# EAGLE design OneWire_I2C (EAGLE 7.2.0)
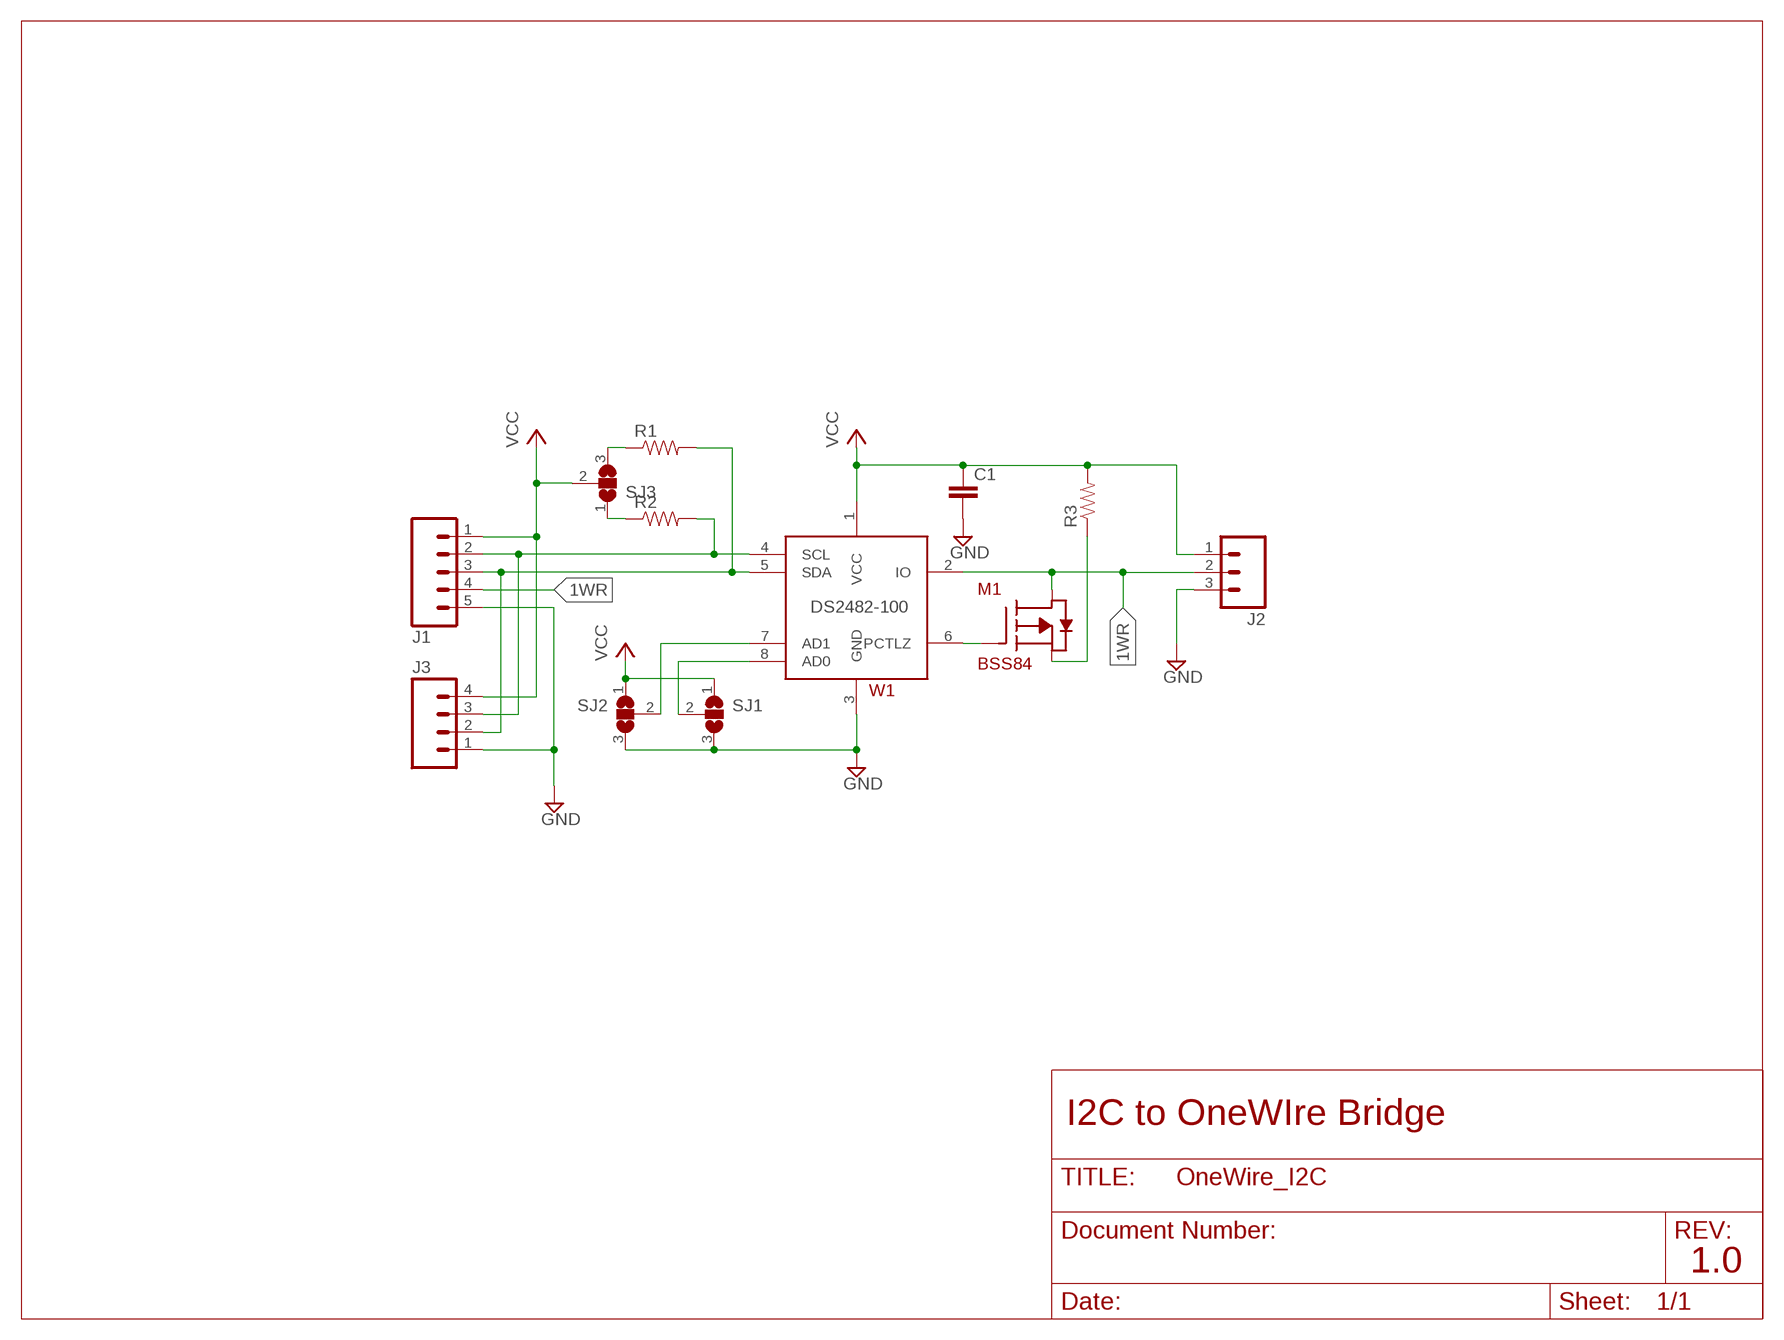
[diagram p0: schematic, sheet 1]

## Parts
C1  CAP0603-CAP  [0603-CAP]
J1  M05PTH  [1X05]
J2  M03SCREW  [SCREWTERMINAL-3.5MM-3]
J3  M04SCREW  [SCREWTERMINAL-3.5MM-4]
M1  BSS84  [SOT-23]
R1  RESISTOR0603  [0603-RES]
R2  RESISTOR0603  [0603-RES]
R3  RESISTORPTH-1/4W  [AXIAL-0.4]
SJ1  SJ2W  [SJ_2]
SJ2  SJ2W  [SJ_2]
SJ3  SJ2W  [SJ_2]
W1  DS2482-100  [SOIC8]

## Nets
1WR: J1.4 J2.2 M1.3 W1.2(IO)
AD0: SJ1.2 W1.8(AD0)
AD1: SJ2.2 W1.7(AD1)
GND: C1.2 J1.5 J2.3 J3.1 SJ1.3 SJ2.3 W1.3(GND)
N$1: M1.1 W1.6(PCTLZ)
N$2: R1.1 SJ3.3
N$3: R2.1 SJ3.1
N$10: M1.2 R3.P$1
SCL: J1.2 J3.3 R2.2 W1.4(SCL)
SDA: J1.3 J3.2 R1.2 W1.5(SDA)
VCC: C1.1 J1.1 J2.1 J3.4 R3.P$2 SJ1.1 SJ2.1 SJ3.2 W1.1(VCC)

## Notes on the sheet
- I2C to OneWIre Bridge
- 1.0

## Library data of the parts
C1 = SparkFun-Capacitors:CAP: Capacitor Standard 0603 ceramic capacitor, and 0.1" leaded capacitor.
J1 = SparkFun-Connectors:M05: Header 5 Standard 5-pin 0.1" header. Use with straight break away headers (SKU : PRT-00116), right angle break away headers (PRT-00553), swiss pins (PRT-00743), machine pins (PRT-00117), and female headers (PRT-00115). Molex polarized connector foot print use with SKU : PRT-08230 with associated crimp pins and housings.
J2 = SparkFun-Connectors:M03: Header 3 Standard 3-pin 0.1" header. Use with straight break away headers (SKU : PRT-00116), right angle break away headers (PRT-00553), swiss pins (PRT-00743), machine pins (PRT-00117), and female headers (PRT-00115). Molex polarized connector foot print use with SKU : PRT-08232 with associated crimp pins and housings.; PROD_ID: CONN-08288
J3 = SparkFun-Connectors:M04: Header 4 Standard 4-pin 0.1" header. Use with straight break away headers (SKU : PRT-00116), right angle break away headers (PRT-00553), swiss pins (PRT-00743), machine pins (PRT-00117), and female headers (PRT-00115). Molex polarized connector foot print use with SKU : PRT-08231 with associated crimp pins and housings. 1MM SMD Version SKU: PRT-10208; PROD_ID: Combine 2x8399
M1 = Puffin:BSS84: BSS84 P-Channel Enhancement Mode Field-Effect Transistor
R1-R3 = SparkFun-Resistors:RESISTOR: Resistor Basic schematic elements and footprints for 0603, 1206, and PTH resistors.
SJ1-SJ3 = jumper:SJ2W: SMD solder JUMPER
W1 = PuffinOneWIre:DS2482-100: DS2482-100 I2C-to-1-Wire® bridge device

## Net classes
0 default: clearance 0.205 mm

## Board
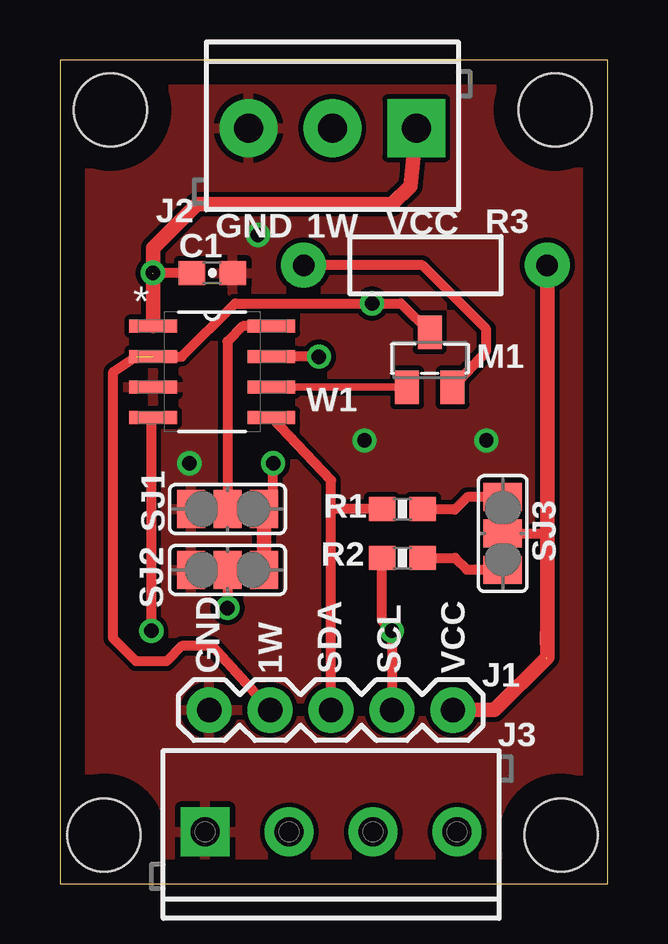
[diagram p1: board, top side]
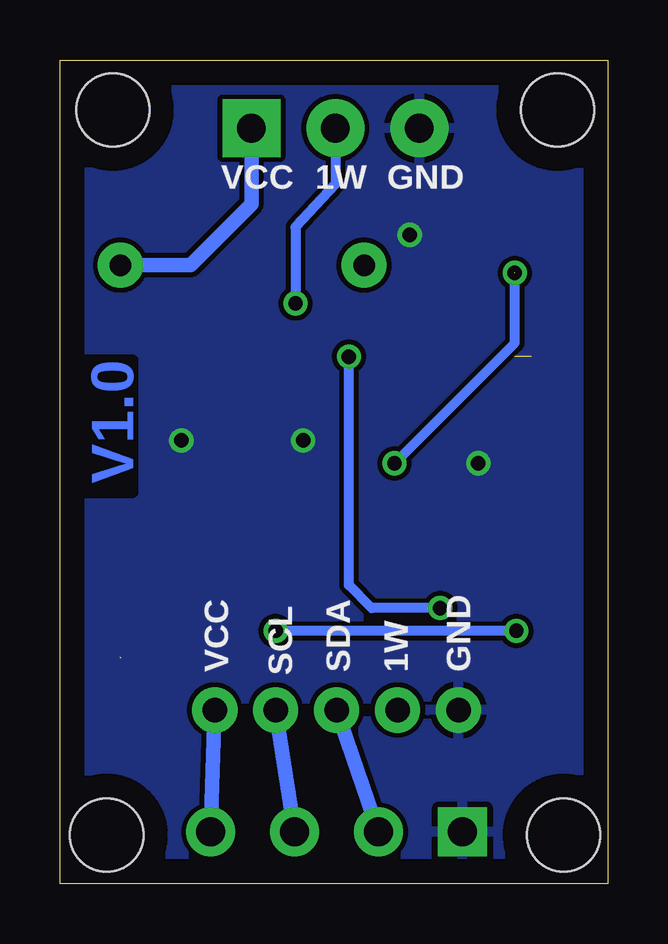
[diagram p2: board, bottom side, seen from below]

Size 22.84 x 34.34 mm. Coordinates in mm from the lower left corner, seen from the top.
Outline: 0,0 22.84,0 22.84,34.34 0,34.34 0,0
Copper layers (1*16): Top 0.035mm / dielectric 1.5mm / Bottom 0.035mm
Design rules "default": minimum track width 10mil, minimum drill 24mil, track to track 8mil, track to pad 8mil, pad to pad 8mil, via to via 8mil, smd to smd 8mil, copper to edge 40mil, drill to drill 8mil, minimum pad ring 10mil, minimum via ring 8mil, stop-mask expansion 4mil, vias tented up to drill 0mil, thermal gap 10mil

### Footprints (pad centres in the part's own frame; a part is rotated, then mirrored left to right if it is on the bottom)
0603-CAP = smd 1.1 x 1: 1 -0.85,0; 2 0.85,0
1X05 = drill 1.016 pad 1.88: 1 0,0; 2 2.54,0; 3 5.08,0; 4 7.62,0; 5 10.16,0
SCREWTERMINAL-3.5MM-3 = drill 1.2 pad 2.413 square: 1 0,0 | drill 1.2 pad 2.413: 2 3.5,0; 3 7,0
SCREWTERMINAL-3.5MM-4 = drill 1.2 pad 2.032 square: 1 0,0 | drill 1.2 pad 2.032: 2 3.5,0; 3 7,0; 4 10.5,0
SOT-23 = smd 1 x 1.4: 1 -0.45,-1.6; 2 1.45,-1.6; 3 0.5,0.7
0603-RES = smd 1.1 x 1: 1 -0.85,0; 2 0.85,0
AXIAL-0.4 = drill 0.9 pad 1.88: P$1 -5.08,0; P$2 5.08,0
SJ_2 = smd 1.168 x 1.6: 1 -1.524,0; 2 0,0; 3 1.524,0
STAND-OFF-TIGHT = hole 3.048: 0,0
SOIC8 = smd 1.981 x 0.533: 1 -2.464,1.905; 2 -2.464,0.635; 3 -2.464,-0.635; 4 -2.464,-1.905; 5 2.464,-1.905; 6 2.464,-0.635; 7 2.464,0.635; 8 2.464,1.905

### Placement (x,y rotation side)
C1  6.35,25.46 0 top
J1  16.38,7.24 180 top
J2  14.86,31.5 180 top
J3  6.06,2.16 0 top
M1  14.92,22.29 0 top
R1  14.28,15.62 180 top
R2  14.28,13.58 180 top
R3  15.24,25.78 0 top
SJ1  6.99,15.62 180 top
SJ2  6.99,13.08 180 top
SJ3  18.46,14.6 90 top
U$1  [STAND-OFF-TIGHT]  2.1,32.26 0 top
U$2  [STAND-OFF-TIGHT]  20.64,32.26 0 top
U$3  [STAND-OFF-TIGHT]  1.84,2.03 0 top
U$4  [STAND-OFF-TIGHT]  20.89,2.03 0 top
W1  6.35,21.34 0 top

### Tracks (layer width: path | path; a pad name or v marks a point on that pad's centre or on a via)
1WR  (via drill 0.6)  (1 unrouted)
  Top 0.406: J1.4 6.35,9.91 5.08,9.91 4.45,9.27 3.17,9.27 2.22,10.22 2.22,21.34 3.17,21.97 | W1.2 5.08,21.97 7.3,24.19 v13.02,24.19 14.22,24.19 M1.3
  Bottom 0.406: J2.2 11.36,29.15 13.02,27.37 v13.02,24.19
AD0
  Top 0.406: W1.8 7.62,23.24 6.99,22.61 SJ1.2
AD1  (via drill 0.6)
  Top 0.406: SJ2.2 v6.99,11.49 | v10.8,21.97 W1.7
  Bottom 0.406: v6.99,11.49 9.84,11.49 10.8,12.45 v10.8,21.97
GND  (via drill 0.6)
  other vias: 8.26,27.05 17.78,18.48 12.7,18.48 5.4,17.53
  pour Top: -0.64,35.31 -0.38,-0.38 23.11,-0.38 22.86,35.31
  pour Bottom: -0.64,35.31 22.86,35.31 22.86,-0.64 -0.64,-0.64
N$1
  Top 0.305: W1.6 14.47,20.7
  Top 0.406: 14.47,20.7 M1.1
N$2
  Top 0.406: SJ3.3 16.98,16.12 16.46,15.6 15.16,15.6 R1.1
N$3
  Top 0.406: R2.1 16.48,13.58 16.96,13.1 18.44,13.1 SJ3.1
N$10
  Top 0.406: M1.2 17.78,22.21 17.78,23.11 15.11,25.78 R3.P$1
SCL  (via drill 0.6)
  Top 0.406: W1.4 3.81,19.43 v3.81,10.54 | J1.2 v13.84,10.54 13.43,10.95 R2.2
  Bottom 0.406: v3.81,10.54 v13.84,10.54
  Bottom 0.61: J3.3 J1.2
SDA
  Top 0.406: J1.3 11.3,15.62 | 11.3,15.62 11.3,16.82 W1.5 | R1.2 11.3,15.62
  Bottom 0.61: J3.2 J1.3
VCC  (via drill 0.6)  (2 unrouted)
  Top 0.406: C1.1 3.89,25.46 | SJ1.1 8.89,16 v8.89,17.53 | SJ3.2 20.32,14.6
  Top 0.61: R3.P$2 20.32,14.6 20.32,9.43 20.31,10.45 | W1.1 3.89,25.46 3.89,26.49 5.71,28.32 13.84,28.32 14.61,29.08 J2.1 | SJ2.1 SJ1.1 | J1.1 18.12,7.24 20.28,9.4
  Bottom 0.406: v8.89,17.53 3.87,22.54 v3.87,25.46
  Bottom 0.61: R3.P$2 17.4,25.78 14.86,28.32 J2.1 | J3.4 J1.1

### Text on the board
Bottom: V1.0
tPlace: GND | 1W | VCC | GND | 1W | SDA | SCL | VCC
bPlace: GND | 1W | VCC | GND | 1W | SDA | VCC | SCL